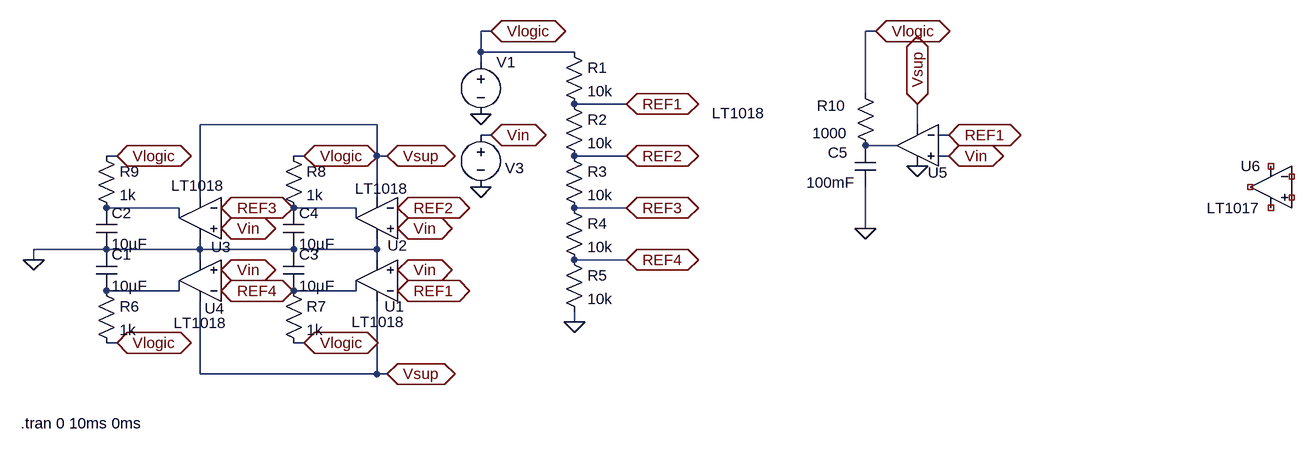
[diagram p0: schematic schem.asc]
schem.asc, the LTspice schematic file:
Version 4
SHEET 1 1268 684
WIRE -112 64 -128 64
WIRE 480 64 464 64
WIRE -128 96 -128 64
WIRE 16 96 -128 96
WIRE -128 112 -128 96
WIRE 464 160 464 64
WIRE 96 176 16 176
WIRE -288 208 -560 208
WIRE 544 208 544 176
WIRE -112 224 -128 224
WIRE 592 224 576 224
WIRE 512 240 464 240
WIRE -688 256 -704 256
WIRE -400 256 -416 256
WIRE -288 256 -288 208
WIRE -272 256 -288 256
WIRE 96 256 16 256
WIRE 592 256 576 256
WIRE -560 320 -560 208
WIRE -288 320 -288 256
WIRE -592 336 -704 336
WIRE -320 336 -416 336
WIRE 96 336 16 336
WIRE -592 352 -592 336
WIRE -320 352 -320 336
WIRE 464 368 464 304
WIRE -704 400 -816 400
WIRE -560 400 -560 384
WIRE -560 400 -704 400
WIRE -416 400 -560 400
WIRE -288 400 -288 384
WIRE -288 400 -400 400
WIRE -816 416 -816 400
WIRE -560 416 -560 400
WIRE -288 416 -288 400
WIRE 96 416 16 416
WIRE -592 464 -592 448
WIRE -592 464 -704 464
WIRE -320 464 -320 448
WIRE -320 464 -416 464
WIRE 16 512 16 496
WIRE -688 544 -704 544
WIRE -400 544 -416 544
WIRE -560 592 -560 480
WIRE -288 592 -288 480
WIRE -288 592 -560 592
WIRE -272 592 -288 592
FLAG 96 176 REF1
IOPIN 96 176 BiDir
FLAG 96 256 REF2
IOPIN 96 256 BiDir
FLAG 96 336 REF3
IOPIN 96 336 BiDir
FLAG 96 416 REF4
IOPIN 96 416 BiDir
FLAG 16 512 0
FLAG -272 256 Vsup
IOPIN -272 256 BiDir
FLAG -816 416 0
FLAG -272 592 Vsup
IOPIN -272 592 BiDir
FLAG -256 464 REF1
IOPIN -256 464 BiDir
FLAG -256 336 REF2
IOPIN -256 336 BiDir
FLAG -528 336 REF3
IOPIN -528 336 BiDir
FLAG -528 464 REF4
IOPIN -528 464 BiDir
FLAG -112 64 Vlogic
IOPIN -112 64 BiDir
FLAG -400 256 Vlogic
IOPIN -400 256 BiDir
FLAG -400 544 Vlogic
IOPIN -400 544 BiDir
FLAG -688 544 Vlogic
IOPIN -688 544 BiDir
FLAG -688 256 Vlogic
IOPIN -688 256 BiDir
FLAG -112 224 Vin
IOPIN -112 224 BiDir
FLAG -256 432 Vin
IOPIN -256 432 BiDir
FLAG -256 368 Vin
IOPIN -256 368 BiDir
FLAG -528 368 Vin
IOPIN -528 368 BiDir
FLAG -528 432 Vin
IOPIN -528 432 BiDir
FLAG 592 224 REF1
IOPIN 592 224 BiDir
FLAG 592 256 Vin
IOPIN 592 256 BiDir
FLAG 544 176 Vsup
IOPIN 544 176 BiDir
FLAG 480 64 Vlogic
IOPIN 480 64 BiDir
FLAG 544 272 0
FLAG -128 192 0
FLAG -128 304 0
FLAG 464 368 0
SYMBOL res 0 80 R0
SYMATTR InstName R1
SYMATTR Value 10k
SYMBOL res 0 160 R0
SYMATTR InstName R2
SYMATTR Value 10k
SYMBOL res 0 240 R0
SYMATTR InstName R3
SYMATTR Value 10k
SYMBOL res 0 320 R0
SYMATTR InstName R4
SYMATTR Value 10k
SYMBOL res 0 400 R0
SYMATTR InstName R5
SYMATTR Value 10k
SYMBOL voltage -128 96 R0
WINDOW 3 24 96 Invisible 2
WINDOW 123 0 0 Left 0
WINDOW 39 0 0 Left 0
SYMATTR InstName V1
SYMATTR Value 5
SYMBOL Comparators\\LT1018 -288 448 R180
WINDOW 0 -43 -40 Left 2
WINDOW 3 230 -65 Left 2
SYMATTR InstName U1
SYMBOL Comparators\\LT1018 -288 352 M0
WINDOW 0 -47 42 Left 2
WINDOW 3 234 -50 Left 2
SYMATTR InstName U2
SYMBOL Comparators\\LT1018 -560 352 M0
WINDOW 0 -48 44 Left 2
WINDOW 3 -321 -46 Left 2
SYMATTR InstName U3
SYMBOL Comparators\\LT1018 -560 448 R180
WINDOW 0 -38 -43 Left 2
WINDOW 3 -316 -64 Left 2
SYMATTR InstName U4
SYMBOL res -720 448 R0
SYMATTR InstName R6
SYMATTR Value 1k
SYMBOL cap -720 400 R0
SYMATTR InstName C1
SYMATTR Value 10µF
SYMBOL cap -720 336 R0
SYMATTR InstName C2
SYMATTR Value 10µF
SYMBOL cap -432 400 R0
SYMATTR InstName C3
SYMATTR Value 10µF
SYMBOL res -432 448 R0
SYMATTR InstName R7
SYMATTR Value 1k
SYMBOL cap -432 336 R0
SYMATTR InstName C4
SYMATTR Value 10µF
SYMBOL res -432 240 R0
SYMATTR InstName R8
SYMATTR Value 1k
SYMBOL res -720 240 R0
SYMATTR InstName R9
SYMATTR Value 1k
SYMBOL voltage -128 208 R0
WINDOW 0 37 67 Left 2
WINDOW 3 24 96 Invisible 2
WINDOW 123 0 0 Left 0
WINDOW 39 0 0 Left 0
SYMATTR InstName V3
SYMATTR Value PULSE(0 5 0 5ms 5ms)
SYMBOL Comparators\\LT1018 544 240 M0
WINDOW 0 -47 42 Left 2
WINDOW 3 234 -50 Left 2
SYMATTR InstName U5
SYMBOL res 448 144 R0
WINDOW 0 -59 35 Left 2
WINDOW 3 -66 77 Left 2
SYMATTR InstName R10
SYMATTR Value 1000
SYMBOL Comparators\\LT1017 1088 304 M0
SYMATTR InstName U6
SYMBOL cap 448 240 R0
WINDOW 0 -42 11 Left 2
WINDOW 3 -75 57 Left 2
SYMATTR InstName C5
SYMATTR Value 100mF
TEXT -836 668 Left 2 !.tran 0 10ms 0ms

The netlist it stands for:
* schem.asc
R1 Vlogic REF1 10k
R2 REF1 REF2 10k
R3 REF2 REF3 10k
R4 REF3 REF4 10k
R5 REF4 0 10k
V1 Vlogic 0 5
XU1 Vin REF1 Vsup N004 N006 LT1018  ; pins In+ In- V+ V- OUT
XU2 Vin REF2 Vsup N004 N003 LT1018  ; pins In+ In- V+ V- OUT
XU3 Vin REF3 Vsup 0 N002 LT1018  ; pins In+ In- V+ V- OUT
XU4 Vin REF4 Vsup 0 N005 LT1018  ; pins In+ In- V+ V- OUT
R6 N005 Vlogic 1k
C1 0 N005 10µF
C2 N002 0 10µF
C3 0 N006 10µF
R7 N006 Vlogic 1k
C4 N003 0 10µF
R8 Vlogic N003 1k
R9 Vlogic N002 1k
V3 Vin 0 PULSE(0 5 0 5ms 5ms)
XU5 Vin REF1 Vsup 0 N001 LT1018  ; pins In+ In- V+ V- OUT
R10 Vlogic N001 1000
XU6 NC_01 NC_02 NC_03 NC_04 NC_05 LT1017  ; pins In+ In- V+ V- OUT
C5 N001 0 100mF
.tran 0 10ms 0ms
.lib LTC1.lib
.backanno
.end